# Altium schematic sheet 04_CapTouch.SchDoc: ECE315 Capacitive Touch
size A; Date: 01/08/2018; ApprovedBy: JSK; CheckedBy: JSK; Author: JSK; CompanyName: University of Wisconsin; DrawnBy: JSK; Engineer: JSK; Organization: ECE 315; Address1: College of Engineering; Address2: 1415 Engineering Drive; Address3: Madison, WI 53706; Address4: ECE 315 Spring 2018; Revision: A; SheetNumber: 4; SheetTotal: 6; AssemblyNumber: ECE315-S18; ApprovedDate: 4/25/2017
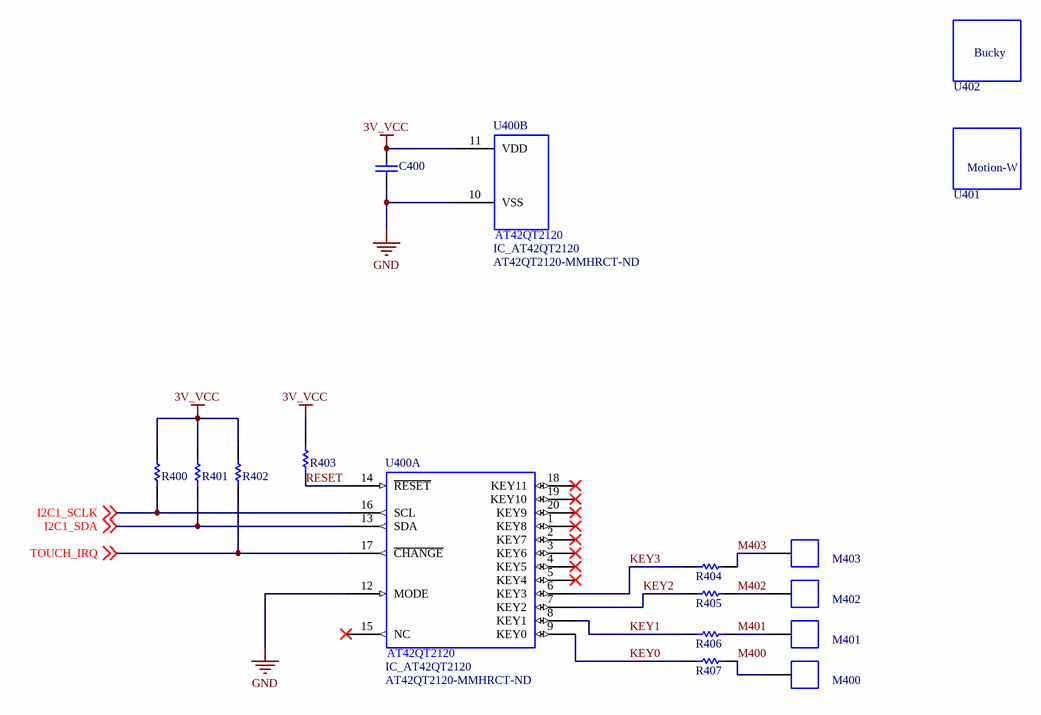
[diagram p0: 04_CapTouch.SchDoc]

## Parts
C400  CAP_0805_U_001.00  [CAP_0805]  (value not drawn)
M400  Mech_TouchPad  [TouchPad]  (value not drawn)  (no BOM)
M401  Mech_TouchPad  [TouchPad]  (value not drawn)  (no BOM)
M402  Mech_TouchPad  [TouchPad]  (value not drawn)  (no BOM)
M403  Mech_TouchPad  [TouchPad]  (value not drawn)  (no BOM)
R400  RES_0805_R_562_00  [RES_0805]  (value not drawn)
R401  RES_0805_R_562_00  [RES_0805]  (value not drawn)
R402  RES_0805_R_562_00  [RES_0805]  (value not drawn)
R403  RES_0805_R_562_00  [RES_0805]  (value not drawn)
R404  RES_0805_R_562_00  [RES_0805]  (value not drawn)
R405  RES_0805_R_562_00  [RES_0805]  (value not drawn)
R406  RES_0805_R_562_00  [RES_0805]  (value not drawn)
R407  RES_0805_R_562_00  [RES_0805]  (value not drawn)
U400  IC_AT42QT2120  Supplier Part Number 1: AT42QT2120-MMHRCT-ND  [IC_AT42QT2120]  (parts A,B of 2)
U401  Motion_W  [Motion_W]  (value not drawn)  (no BOM)
U402  Bucky  [BuckyBadger]  (value not drawn)  (no BOM)

## Nets
3V_VCC: C400.1 R400.2 R401.2 R402.2 R403.2 U400.11(VDD)
GND: C400.2 U400.10(VSS) U400.12(MODE)
I2C1_SCLK: R400.1 U400.16(SCL) ; off-sheet I2C1_SCLK
I2C1_SDA: R401.1 U400.13(SDA) ; off-sheet I2C1_SDA
KEY0: R407.1 U400.9(KEY0)
KEY1: R406.1 U400.8(KEY1)
KEY2: R405.1 U400.7(KEY2)
KEY3: R404.1 U400.6(KEY3)
M400: M400.1 R407.2
M401: M401.1 R406.2
M402: M402.1 R405.2
M403: M403.1 R404.2
RESET: R403.1 U400.14(~{RESET})
TOUCH_IRQ: R402.1 U400.17(~{CHANGE}) ; off-sheet TOUCH_IRQ

Not connected (* = marked no-connect by the designer): U400 1(KEY8)* 2(KEY7)* 3(KEY6)* 4(KEY5)* 5(KEY4)* 15(NC)* 18(KEY11)* 19(KEY10)* 20(KEY9)*

## Notes on the sheet
- Title:
- Size:
- A
- Machine:
- P.C. Board No:
- Assembly No:
- Rev:
- Sheet:
- of
- College of Engineering
- 1415 Engineering Drive
- Madison, WI 53706
- (in symbol IC_AT42QT2120, part A) AT42QT2120
- (in symbol IC_AT42QT2120, part B) AT42QT2120
- (in symbol Motion_W) Motion-W

## Library data of the parts
C400 = CAP_0805_U_001.00: CAP CER 1UF 16V 10% X7R 0805; Manufacturer: Yageo; Manufacturer Part Number: CC0805KKX7R7BB105; Notification: Current market demand for these product types have resulted in fluctuating and extending lead times. Lead times may differ.; Supplier 1: Digi-Key; RoHS: RoHS Compliant; Category: Capacitors; Stock 1: 1059529; Pricing 1: 1=0.11, 10=0.079, 100=0.0352, 500=0.02516, 1000=0.01977 (USD); Packaging: Cut Tape (CT); Part Status: Active; Tolerance: ±10%; Voltage - Rated: 16V; Temperature Coefficient: X7R; Operating Temperature: -55°C ~ 125°C; Features: -; Ratings: -; Applications: General Purpose; Failure Rate: -; Mounting Type: Surface Mount, MLCC; Package / Case: 0805 (2012 Metric); Size / Dimension: 0.079" L x 0.049" W (2.00mm x 1.25mm); Height - Seated (Max): -; Thickness (Max): 0.049" (1.25mm); Lead Spacing: -; Lead Style: -; ComponentLink1URL: http://www.yageo.com/documents/recent/UPY-GPHC_X7R_6.3V-to-50V_18.pdf; ComponentLink1Description: http://www.yageo.com/documents/recent/UPY-GPHC_X7R_6.3V-to-50V_18.pdf; Supplier Part Number 1: 311-1365-1-ND
M400-M403 = Mech_TouchPad: Capacative Touch Sensor Pad
R400-R407 = RES_0805_R_562_00: RES SMD 562 OHM 1% 1/8W 0805; Manufacturer: Yageo; Manufacturer Part Number: RC0805FR-07562RL; Power (Watts): 0.125W, 1/8W; Temperature Coefficient: ±100ppm/°C; Supplier 1: Digi-Key; RoHS: RoHS Compliant; Category: Resistors; Stock 1: 495223; Pricing 1: 1=0.1, 10=0.022, 100=0.0088, 1000=0.00396, 2500=0.00344 (USD); Packaging: Cut Tape (CT); Part Status: Active; Tolerance: ±1%; Composition: Thick Film; Features: Moisture Resistant; Operating Temperature: -55°C ~ 155°C; Package / Case: 0805 (2012 Metric); Supplier Device Package: 0805; Size / Dimension: 0.079" L x 0.049" W (2.00mm x 1.25mm); Height - Seated (Max): 0.024" (0.60mm); Failure Rate: -; ComponentLink1URL: http://www.yageo.com/documents/recent/PYu-RC_Group_51_RoHS_L_8.pdf; ComponentLink1Description: http://www.yageo.com/documents/recent/PYu-RC_Group_51_RoHS_L_8.pdf; Supplier Part Number 1: 311-562CRCT-ND
U400 = IC_AT42QT2120: Manufacturer: Microchip Technology; Manufacturer Part Number: AT42QT2120-MMHR; Proximity Detection: Yes; Number of Inputs: Up to 12; LED Driver Channels: Up to 10; Interface: I²C; Voltage - Supply: 1.8 V ~ 5.5 V; Supplier 1: Digi-Key; RoHS: RoHS Compliant; Category: Integrated Circuits (ICs); Stock 1: 5883; Pricing 1: 1=1.47, 25=1.3464, 100=1.219 (USD); Packaging: Cut Tape (CT); Part Status: Active; Type: Buttons, Slider, Wheel; Resolution: -; Current - Supply: -; Operating Temperature: -40°C ~ 85°C; Package / Case: 20-VFQFN Exposed Pad; Supplier Device Package: 20-VQFN (3x3); ComponentLink1URL: http://www.microchip.com/mymicrochip/filehandler.aspx?ddocname=en590755; ComponentLink1Description: http://www.microchip.com/mymicrochip/filehandler.aspx?ddocname=en590755
U401 = Motion_W: Motion W Image; Manufacturer Part Number: UW Bucky
U402 = Bucky: Bucky Badger Image; Manufacturer Part Number: UW Bucky